# Altium project 388D_Control_v1.PrjPcb (part 3 of 3)

## Sheet 9.Pwm_Buffer.SchDoc
size A3; SheetNumber: 10; SheetTotal: 10
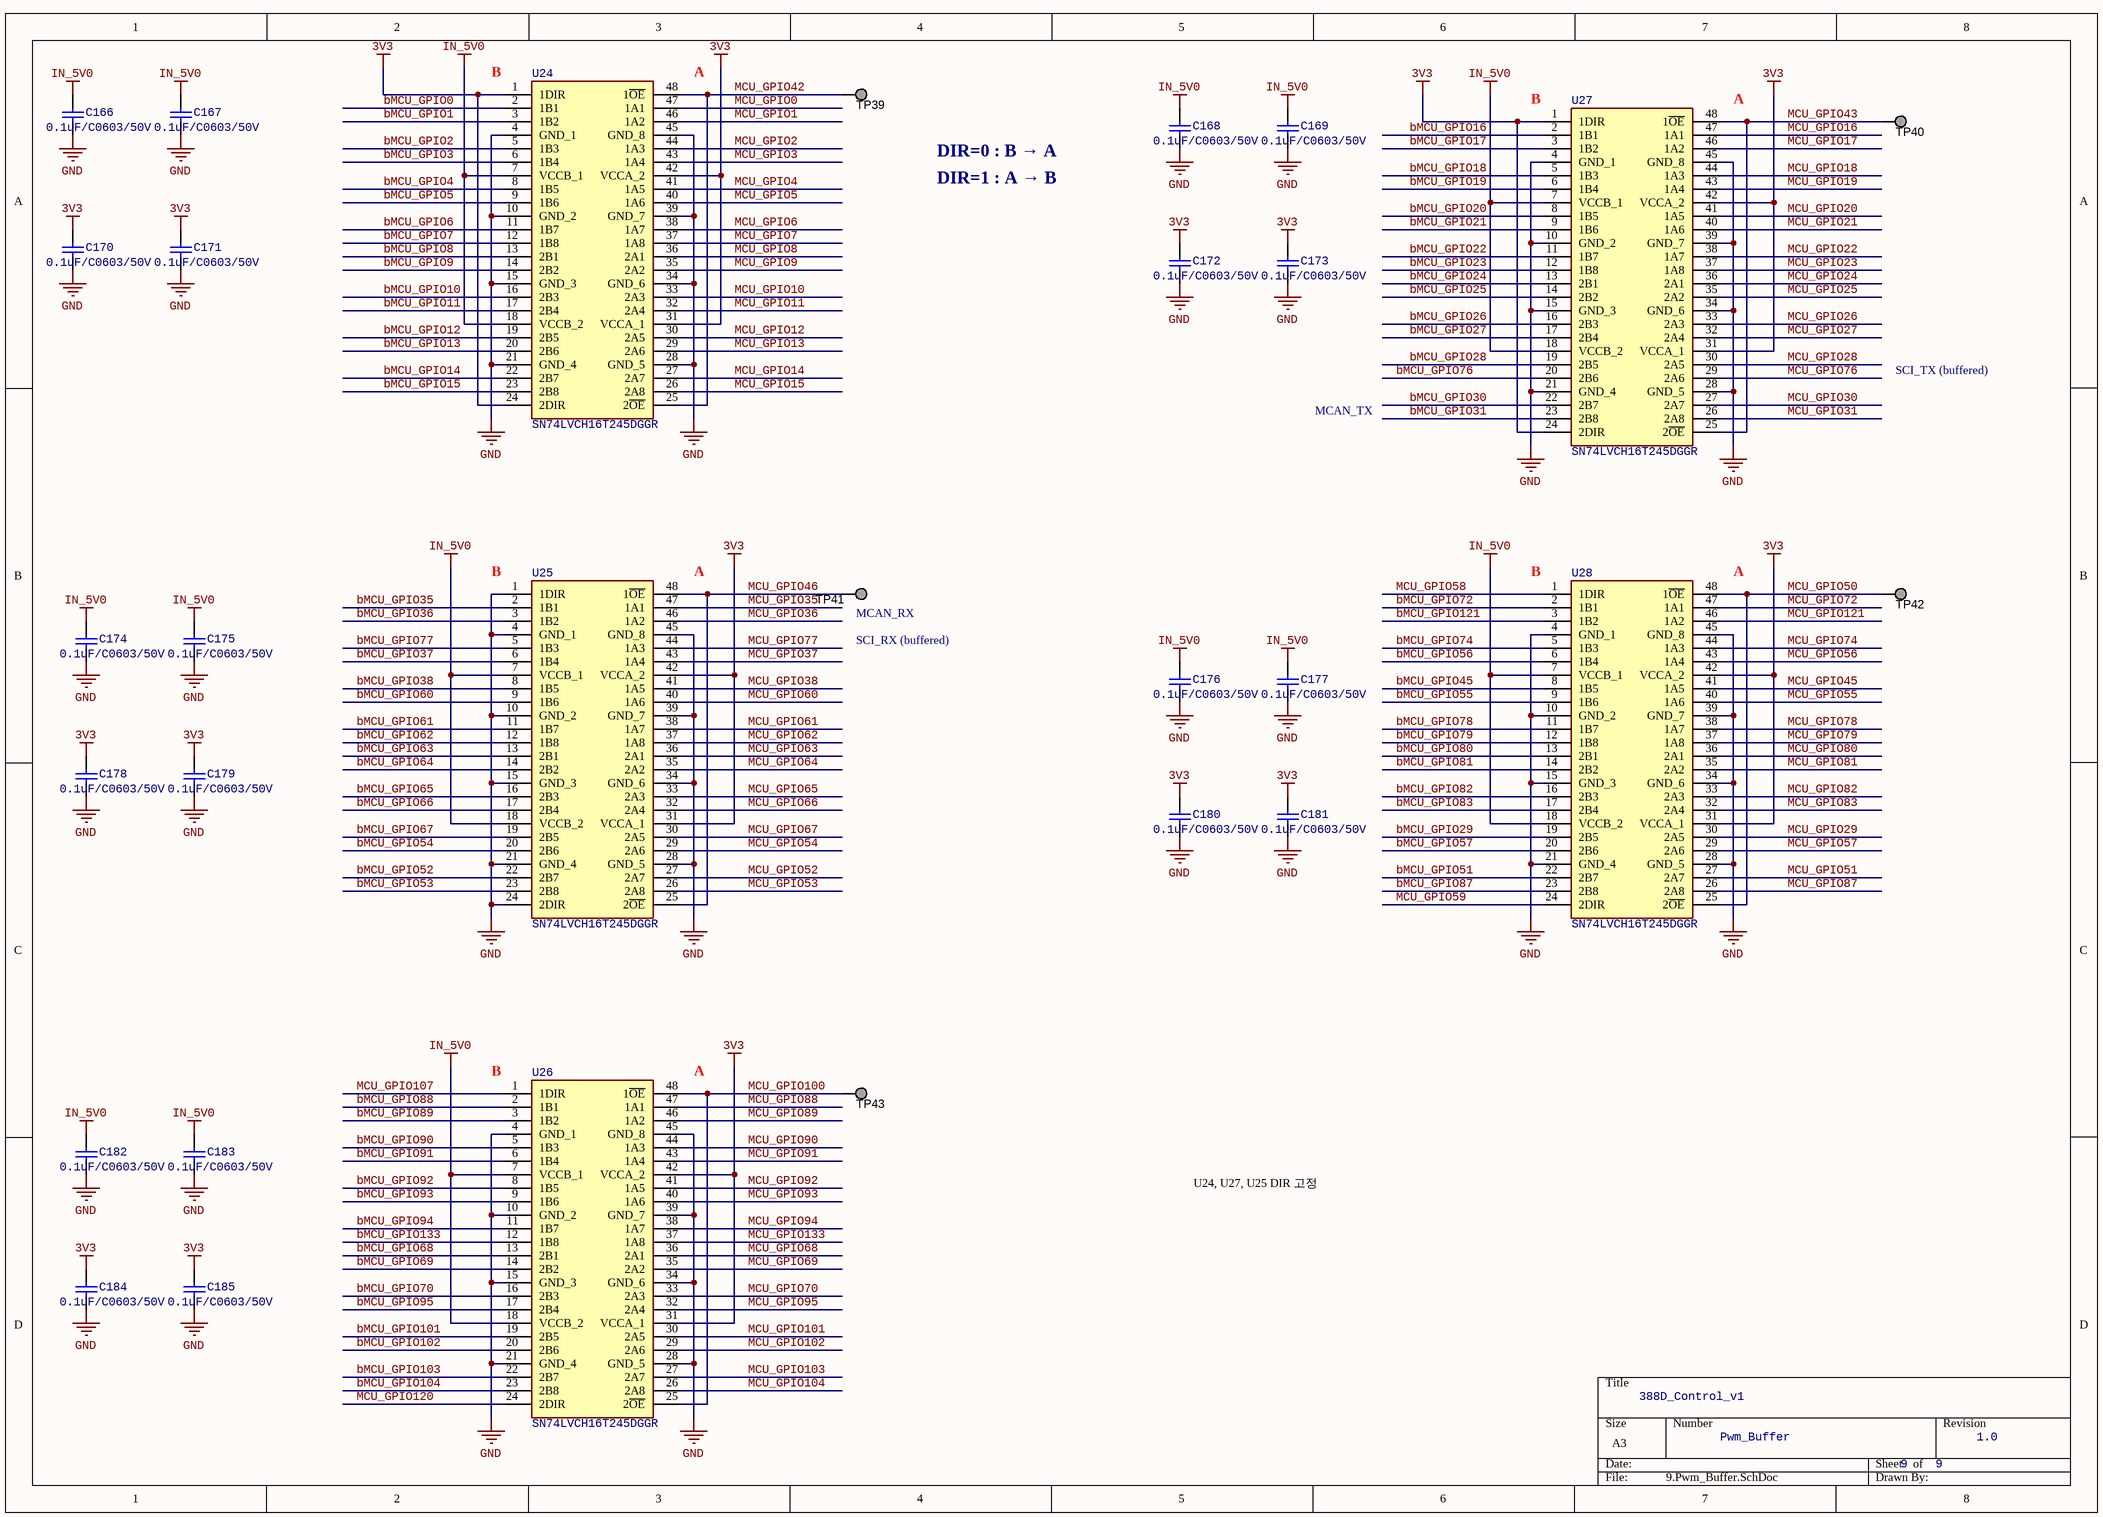
[diagram p8: 9.Pwm_Buffer.SchDoc]

### Parts
C166  value 0.1uF/C0603/50V  [CAPC1608X90X40NL10T20]  (hidden comment: Capacitor 100 nF +/-10% 50 V 0603)
C167  value 0.1uF/C0603/50V  [CAPC1608X90X40NL10T20]  (hidden comment: Capacitor 100 nF +/-10% 50 V 0603)
C168  value 0.1uF/C0603/50V  [CAPC1608X90X40NL10T20]  (hidden comment: Capacitor 100 nF +/-10% 50 V 0603)
C169  value 0.1uF/C0603/50V  [CAPC1608X90X40NL10T20]  (hidden comment: Capacitor 100 nF +/-10% 50 V 0603)
C170  value 0.1uF/C0603/50V  [CAPC1608X90X40NL10T20]  (hidden comment: Capacitor 100 nF +/-10% 50 V 0603)
C171  value 0.1uF/C0603/50V  [CAPC1608X90X40NL10T20]  (hidden comment: Capacitor 100 nF +/-10% 50 V 0603)
C172  value 0.1uF/C0603/50V  [CAPC1608X90X40NL10T20]  (hidden comment: Capacitor 100 nF +/-10% 50 V 0603)
C173  value 0.1uF/C0603/50V  [CAPC1608X90X40NL10T20]  (hidden comment: Capacitor 100 nF +/-10% 50 V 0603)
C174  value 0.1uF/C0603/50V  [CAPC1608X90X40NL10T20]  (hidden comment: Capacitor 100 nF +/-10% 50 V 0603)
C175  value 0.1uF/C0603/50V  [CAPC1608X90X40NL10T20]  (hidden comment: Capacitor 100 nF +/-10% 50 V 0603)
C176  value 0.1uF/C0603/50V  [CAPC1608X90X40NL10T20]  (hidden comment: Capacitor 100 nF +/-10% 50 V 0603)
C177  value 0.1uF/C0603/50V  [CAPC1608X90X40NL10T20]  (hidden comment: Capacitor 100 nF +/-10% 50 V 0603)
C178  value 0.1uF/C0603/50V  [CAPC1608X90X40NL10T20]  (hidden comment: Capacitor 100 nF +/-10% 50 V 0603)
C179  value 0.1uF/C0603/50V  [CAPC1608X90X40NL10T20]  (hidden comment: Capacitor 100 nF +/-10% 50 V 0603)
C180  value 0.1uF/C0603/50V  [CAPC1608X90X40NL10T20]  (hidden comment: Capacitor 100 nF +/-10% 50 V 0603)
C181  value 0.1uF/C0603/50V  [CAPC1608X90X40NL10T20]  (hidden comment: Capacitor 100 nF +/-10% 50 V 0603)
C182  value 0.1uF/C0603/50V  [CAPC1608X90X40NL10T20]  (hidden comment: Capacitor 100 nF +/-10% 50 V 0603)
C183  value 0.1uF/C0603/50V  [CAPC1608X90X40NL10T20]  (hidden comment: Capacitor 100 nF +/-10% 50 V 0603)
C184  value 0.1uF/C0603/50V  [CAPC1608X90X40NL10T20]  (hidden comment: Capacitor 100 nF +/-10% 50 V 0603)
C185  value 0.1uF/C0603/50V  [CAPC1608X90X40NL10T20]  (hidden comment: Capacitor 100 nF +/-10% 50 V 0603)
TP39  TESTPOINT  [TP_50MIL-25MILHOLE]  (value not drawn)  (no BOM)
TP40  TESTPOINT  [TP_50MIL-25MILHOLE]  (value not drawn)  (no BOM)
TP41  TESTPOINT  [TP_50MIL-25MILHOLE]  (value not drawn)  (no BOM)
TP42  TESTPOINT  [TP_50MIL-25MILHOLE]  (value not drawn)  (no BOM)
TP43  TESTPOINT  [TP_50MIL-25MILHOLE]  (value not drawn)  (no BOM)
U24  SN74LVCH16T245DGGR  [SOP50P810X120-48N]
U25  SN74LVCH16T245DGGR  [SOP50P810X120-48N]
U26  SN74LVCH16T245DGGR  [SOP50P810X120-48N]
U27  SN74LVCH16T245DGGR  [SOP50P810X120-48N]
U28  SN74LVCH16T245DGGR  [SOP50P810X120-48N]

### Nets
3V3: C170.1 C171.1 C172.1 C173.1 C178.1 C179.1 C180.1 C181.1 C184.1 C185.1 U24.1(1DIR) U24.24(2DIR) U24.31(VCCA_1) U24.42(VCCA_2) U25.31(VCCA_1) U25.42(VCCA_2) U26.31(VCCA_1) U26.42(VCCA_2) U27.1(1DIR) U27.24(2DIR) U27.31(VCCA_1) U27.42(VCCA_2) U28.31(VCCA_1) U28.42(VCCA_2)
GND: C166.2 C167.2 C168.2 C169.2 C170.2 C171.2 C172.2 C173.2 C174.2 C175.2 C176.2 C177.2 C178.2 C179.2 C180.2 C181.2 C182.2 C183.2 C184.2 C185.2 U24.4(GND_1) U24.10(GND_2) U24.15(GND_3) U24.21(GND_4) U24.28(GND_5) U24.34(GND_6) U24.39(GND_7) U24.45(GND_8) U25.1(1DIR) U25.4(GND_1) U25.10(GND_2) U25.15(GND_3) U25.21(GND_4) U25.24(2DIR) U25.28(GND_5) U25.34(GND_6) U25.39(GND_7) U25.45(GND_8) U26.4(GND_1) U26.10(GND_2) U26.15(GND_3) U26.21(GND_4) U26.28(GND_5) U26.34(GND_6) U26.39(GND_7) U26.45(GND_8) U27.4(GND_1) U27.10(GND_2) U27.15(GND_3) U27.21(GND_4) U27.28(GND_5) U27.34(GND_6) U27.39(GND_7) U27.45(GND_8) U28.4(GND_1) U28.10(GND_2) U28.15(GND_3) U28.21(GND_4) U28.28(GND_5) U28.34(GND_6) U28.39(GND_7) U28.45(GND_8)
IN_5V0: C166.1 C167.1 C168.1 C169.1 C174.1 C175.1 C176.1 C177.1 C182.1 C183.1 U24.7(VCCB_1) U24.18(VCCB_2) U25.7(VCCB_1) U25.18(VCCB_2) U26.7(VCCB_1) U26.18(VCCB_2) U27.7(VCCB_1) U27.18(VCCB_2) U28.7(VCCB_1) U28.18(VCCB_2)
bMCU_GPIO0: U24.2(1B1)
bMCU_GPIO1: U24.3(1B2)
bMCU_GPIO2: U24.5(1B3)
bMCU_GPIO3: U24.6(1B4)
bMCU_GPIO4: U24.8(1B5)
bMCU_GPIO5: U24.9(1B6)
bMCU_GPIO6: U24.11(1B7)
bMCU_GPIO7: U24.12(1B8)
bMCU_GPIO8: U24.13(2B1)
bMCU_GPIO9: U24.14(2B2)
bMCU_GPIO10: U24.16(2B3)
bMCU_GPIO11: U24.17(2B4)
bMCU_GPIO12: U24.19(2B5)
bMCU_GPIO13: U24.20(2B6)
bMCU_GPIO14: U24.22(2B7)
bMCU_GPIO15: U24.23(2B8)
bMCU_GPIO16: U27.2(1B1)
bMCU_GPIO17: U27.3(1B2)
bMCU_GPIO18: U27.5(1B3)
bMCU_GPIO19: U27.6(1B4)
bMCU_GPIO20: U27.8(1B5)
bMCU_GPIO21: U27.9(1B6)
bMCU_GPIO22: U27.11(1B7)
bMCU_GPIO23: U27.12(1B8)
bMCU_GPIO24: U27.13(2B1)
bMCU_GPIO25: U27.14(2B2)
bMCU_GPIO26: U27.16(2B3)
bMCU_GPIO27: U27.17(2B4)
bMCU_GPIO28: U27.19(2B5)
bMCU_GPIO29: U28.19(2B5)
bMCU_GPIO30: U27.22(2B7)
bMCU_GPIO31: U27.23(2B8)
bMCU_GPIO35: U25.2(1B1)
bMCU_GPIO36: U25.3(1B2)
bMCU_GPIO37: U25.6(1B4)
bMCU_GPIO38: U25.8(1B5)
bMCU_GPIO45: U28.8(1B5)
bMCU_GPIO51: U28.22(2B7)
bMCU_GPIO52: U25.22(2B7)
bMCU_GPIO53: U25.23(2B8)
bMCU_GPIO54: U25.20(2B6)
bMCU_GPIO55: U28.9(1B6)
bMCU_GPIO56: U28.6(1B4)
bMCU_GPIO57: U28.20(2B6)
bMCU_GPIO60: U25.9(1B6)
bMCU_GPIO61: U25.11(1B7)
bMCU_GPIO62: U25.12(1B8)
bMCU_GPIO63: U25.13(2B1)
bMCU_GPIO64: U25.14(2B2)
bMCU_GPIO65: U25.16(2B3)
bMCU_GPIO66: U25.17(2B4)
bMCU_GPIO67: U25.19(2B5)
bMCU_GPIO68: U26.13(2B1)
bMCU_GPIO69: U26.14(2B2)
bMCU_GPIO70: U26.16(2B3)
bMCU_GPIO72: U28.2(1B1)
bMCU_GPIO74: U28.5(1B3)
bMCU_GPIO76: U27.20(2B6)
bMCU_GPIO77: U25.5(1B3)
bMCU_GPIO78: U28.11(1B7)
bMCU_GPIO79: U28.12(1B8)
bMCU_GPIO80: U28.13(2B1)
bMCU_GPIO81: U28.14(2B2)
bMCU_GPIO82: U28.16(2B3)
bMCU_GPIO83: U28.17(2B4)
bMCU_GPIO87: U28.23(2B8)
bMCU_GPIO88: U26.2(1B1)
bMCU_GPIO89: U26.3(1B2)
bMCU_GPIO90: U26.5(1B3)
bMCU_GPIO91: U26.6(1B4)
bMCU_GPIO92: U26.8(1B5)
bMCU_GPIO93: U26.9(1B6)
bMCU_GPIO94: U26.11(1B7)
bMCU_GPIO95: U26.17(2B4)
bMCU_GPIO101: U26.19(2B5)
bMCU_GPIO102: U26.20(2B6)
bMCU_GPIO103: U26.22(2B7)
bMCU_GPIO104: U26.23(2B8)
bMCU_GPIO121: U28.3(1B2)
bMCU_GPIO133: U26.12(1B8)
MCU_GPIO0: U24.47(1A1)
MCU_GPIO1: U24.46(1A2)
MCU_GPIO2: U24.44(1A3)
MCU_GPIO3: U24.43(1A4)
MCU_GPIO4: U24.41(1A5)
MCU_GPIO5: U24.40(1A6)
MCU_GPIO6: U24.38(1A7)
MCU_GPIO7: U24.37(1A8)
MCU_GPIO8: U24.36(2A1)
MCU_GPIO9: U24.35(2A2)
MCU_GPIO10: U24.33(2A3)
MCU_GPIO11: U24.32(2A4)
MCU_GPIO12: U24.30(2A5)
MCU_GPIO13: U24.29(2A6)
MCU_GPIO14: U24.27(2A7)
MCU_GPIO15: U24.26(2A8)
MCU_GPIO16: U27.47(1A1)
MCU_GPIO17: U27.46(1A2)
MCU_GPIO18: U27.44(1A3)
MCU_GPIO19: U27.43(1A4)
MCU_GPIO20: U27.41(1A5)
MCU_GPIO21: U27.40(1A6)
MCU_GPIO22: U27.38(1A7)
MCU_GPIO23: U27.37(1A8)
MCU_GPIO24: U27.36(2A1)
MCU_GPIO25: U27.35(2A2)
MCU_GPIO26: U27.33(2A3)
MCU_GPIO27: U27.32(2A4)
MCU_GPIO28: U27.30(2A5)
MCU_GPIO29: U28.30(2A5)
MCU_GPIO30: U27.27(2A7)
MCU_GPIO31: U27.26(2A8)
MCU_GPIO35: U25.47(1A1)
MCU_GPIO36: U25.46(1A2)
MCU_GPIO37: U25.43(1A4)
MCU_GPIO38: U25.41(1A5)
MCU_GPIO42: TP39.1 U24.25(2~{OE}) U24.48(1~{OE})
MCU_GPIO43: TP40.1 U27.25(2~{OE}) U27.48(1~{OE})
MCU_GPIO45: U28.41(1A5)
MCU_GPIO46: TP41.1 U25.25(2~{OE}) U25.48(1~{OE})
MCU_GPIO50: TP42.1 U28.25(2~{OE}) U28.48(1~{OE})
MCU_GPIO51: U28.27(2A7)
MCU_GPIO52: U25.27(2A7)
MCU_GPIO53: U25.26(2A8)
MCU_GPIO54: U25.29(2A6)
MCU_GPIO55: U28.40(1A6)
MCU_GPIO56: U28.43(1A4)
MCU_GPIO57: U28.29(2A6)
MCU_GPIO58: U28.1(1DIR)
MCU_GPIO59: U28.24(2DIR)
MCU_GPIO60: U25.40(1A6)
MCU_GPIO61: U25.38(1A7)
MCU_GPIO62: U25.37(1A8)
MCU_GPIO63: U25.36(2A1)
MCU_GPIO64: U25.35(2A2)
MCU_GPIO65: U25.33(2A3)
MCU_GPIO66: U25.32(2A4)
MCU_GPIO67: U25.30(2A5)
MCU_GPIO68: U26.36(2A1)
MCU_GPIO69: U26.35(2A2)
MCU_GPIO70: U26.33(2A3)
MCU_GPIO72: U28.47(1A1)
MCU_GPIO74: U28.44(1A3)
MCU_GPIO76: U27.29(2A6)
MCU_GPIO77: U25.44(1A3)
MCU_GPIO78: U28.38(1A7)
MCU_GPIO79: U28.37(1A8)
MCU_GPIO80: U28.36(2A1)
MCU_GPIO81: U28.35(2A2)
MCU_GPIO82: U28.33(2A3)
MCU_GPIO83: U28.32(2A4)
MCU_GPIO87: U28.26(2A8)
MCU_GPIO88: U26.47(1A1)
MCU_GPIO89: U26.46(1A2)
MCU_GPIO90: U26.44(1A3)
MCU_GPIO91: U26.43(1A4)
MCU_GPIO92: U26.41(1A5)
MCU_GPIO93: U26.40(1A6)
MCU_GPIO94: U26.38(1A7)
MCU_GPIO95: U26.32(2A4)
MCU_GPIO100: TP43.1 U26.25(2~{OE}) U26.48(1~{OE})
MCU_GPIO101: U26.30(2A5)
MCU_GPIO102: U26.29(2A6)
MCU_GPIO103: U26.27(2A7)
MCU_GPIO104: U26.26(2A8)
MCU_GPIO107: U26.1(1DIR)
MCU_GPIO120: U26.24(2DIR)
MCU_GPIO121: U28.46(1A2)
MCU_GPIO133: U26.37(1A8)

### Notes on the sheet
- (near U24) B
- (near U24) A
- (near U27) B
- (near U27) A
- DIR=0 : B → A
- DIR=1 : A → B
- SCI_TX (buffered)
- MCAN_TX
- (near U25) B
- (near U25) A
- (near U28) B
- (near U28) A
- (near TP41) MCAN_RX
- (near TP41) SCI_RX (buffered)
- (near U26) B
- (near U26) A
- U24, U27, U25 DIR 고정
- 388D_Control_v1
- Pwm_Buffer
- 9    9
- 1.0

### Library data of the parts
C166-C185 = CMP-001-00017-6: Chip Capacitor, 100 nF, +/- 10%, 50 V, 0603 (1608 Metric); Voltage Rating: 50V; Capacitor Type: Ceramic; Tolerance: 10%; Mounting Technology: SM; Max Operating Temperature: 125°C; RoHS Compliant: True; Pins: 2; Case/Package: 0603; Min Operating Temperature: -55°C
TP39-TP43 = CMP-0078143-3: TEST POINT.  No entry in BOM.; CompType: Testpoint; PackageReference: N/A; Manufacturer: N/A; PartNumber: N/A; Library Reference: TESTPOINT
U24-U28 = CMP-031-00095-1: 16-Bit Dual-Supply Bus Transceiver; Manufacturer_Name: Texas Instruments; Arrow Part Number: SN74LVCH16T245DGGR; Source: 388D_Control_v1.SchLib; Arrow Price/Stock: https://www.arrow.com/en/products/sn74lvch16t245dggr/texas-instruments; Height: 1.2mm; Mouser Part Number: 595-SN74LVCH16T245GR; Manufacturer_Part_Number: SN74LVCH16T245DGGR; Datasheet Link: http://www.ti.com/lit/gpn/sn74lvch16t245; Mouser Price/Stock: https://www.mouser.co.uk/ProductDetail/Texas-Instruments/SN74LVCH16T245DGGR?qs=dT9u2OTAaVU%2FCf3PTalIAw%3D%3D; Design Item ID: SN74LVCH16T245DGGR

## Nets that join several sheets
3V3: 1.GPIO (J2.21), 4.Power (10 pins), 9.Pwm_Buffer (24 pins)
GND: 1.GPIO (19 pins), 2.Support (20 pins), 3.ADC (40 pins), 4.Power (120 pins), 5.ETH (J12.9 J12.51 J12.83), 8.Emulator_Interface (6 pins), 9.Pwm_Buffer (62 pins)
HSEC_5V0: 1.GPIO (5 pins), 4.Power (D1.2 TP1.1)
IN_5V0: 4.Power (7 pins), 9.Pwm_Buffer (20 pins)
VDD_1V2: 1.GPIO (J2.20), 2.Support (U7.3), 4.Power (25 pins)
VDD_3V3: 1.GPIO (8 pins), 2.Support (21 pins), 4.Power (51 pins), 8.Emulator_Interface (7 pins)
VDDA_3V3: 3.ADC (9 pins), 4.Power (6 pins)
ADC_A0A1_N: 1.GPIO (J1.58), 3.ADC (R11.2)
ADC_A0A1_P: 1.GPIO (J1.60), 3.ADC (R10.2)
ADC_A2A3_N: 1.GPIO (J1.59), 3.ADC (R13.2)
ADC_A2A3_P: 1.GPIO (J1.61), 3.ADC (R12.2)
ADC_A4A5_N: 1.GPIO (J1.53), 3.ADC (R15.2)
ADC_A4A5_P: 1.GPIO (J1.55), 3.ADC (R14.2)
ADC_B0B1_N: 1.GPIO (J1.66), 3.ADC (R20.2)
ADC_B0B1_P: 1.GPIO (J1.64), 3.ADC (R19.2)
ADC_B2B3_N: 1.GPIO (J1.65), 3.ADC (R22.2)
ADC_B2B3_P: 1.GPIO (J1.63), 3.ADC (R21.2)
ADC_B4B5_N: 1.GPIO (J1.70), 3.ADC (R24.2)
ADC_B4B5_P: 1.GPIO (J1.68), 3.ADC (R23.2)
ADC_C2C3_N: 1.GPIO (J1.52), 3.ADC (R27.2)
ADC_C2C3_P: 1.GPIO (J1.54), 3.ADC (R26.2)
ADC_C4C5_N: 1.GPIO (J1.47), 3.ADC (R29.2)
ADC_C4C5_P: 1.GPIO (J1.49), 3.ADC (R28.2)
ADC_D0D1_N: 1.GPIO (J1.71), 3.ADC (R32.2)
ADC_D0D1_P: 1.GPIO (J1.69), 3.ADC (R31.2)
ADC_D2D3_N: 1.GPIO (J1.77), 3.ADC (R34.2)
ADC_D2D3_P: 1.GPIO (J1.75), 3.ADC (R33.2)
ADC_D4D5_N: 1.GPIO (J1.82), 3.ADC (R36.2)
ADC_D4D5_P: 1.GPIO (J1.80), 3.ADC (R35.2)
ADC_IN1415_N: 1.GPIO (J1.74), 3.ADC (R18.2)
ADC_IN1415_P: 1.GPIO (J1.76), 3.ADC (R17.2)
bMCU_GPIO0: 1.GPIO (J1.9 TP15.1), 9.Pwm_Buffer (U24.2)
bMCU_GPIO1: 1.GPIO (J1.11 TP16.1), 9.Pwm_Buffer (U24.3)
bMCU_GPIO2: 1.GPIO (J1.13 TP17.1), 9.Pwm_Buffer (U24.5)
bMCU_GPIO3: 1.GPIO (J1.15 TP19.1), 9.Pwm_Buffer (U24.6)
bMCU_GPIO4: 1.GPIO (J1.14 TP18.1), 9.Pwm_Buffer (U24.8)
bMCU_GPIO5: 1.GPIO (J1.16 TP20.1), 9.Pwm_Buffer (U24.9)
bMCU_GPIO6: 1.GPIO (J1.18 TP21.1), 9.Pwm_Buffer (U24.11)
bMCU_GPIO7: 1.GPIO (J1.20 TP23.1), 9.Pwm_Buffer (U24.12)
bMCU_GPIO8: 1.GPIO (J1.19 TP22.1), 9.Pwm_Buffer (U24.13)
bMCU_GPIO9: 1.GPIO (J1.21 TP24.1), 9.Pwm_Buffer (U24.14)
bMCU_GPIO10: 1.GPIO (J1.23 TP25.1), 9.Pwm_Buffer (U24.16)
bMCU_GPIO11: 1.GPIO (J1.25 TP27.1), 9.Pwm_Buffer (U24.17)
bMCU_GPIO12: 1.GPIO (J1.24 TP26.1), 9.Pwm_Buffer (U24.19)
bMCU_GPIO13: 1.GPIO (J1.26 TP28.1), 9.Pwm_Buffer (U24.20)
bMCU_GPIO14: 1.GPIO (J1.28 TP29.1), 9.Pwm_Buffer (U24.22)
bMCU_GPIO15: 1.GPIO (J1.30 TP31.1), 9.Pwm_Buffer (U24.23)
bMCU_GPIO16: 1.GPIO (J1.29 TP30.1), 9.Pwm_Buffer (U27.2)
bMCU_GPIO17: 1.GPIO (J1.31 TP32.1), 9.Pwm_Buffer (U27.3)
bMCU_GPIO18: 1.GPIO (J1.33 TP33.1), 9.Pwm_Buffer (U27.5)
bMCU_GPIO19: 1.GPIO (J1.35 TP35.1), 9.Pwm_Buffer (U27.6)
bMCU_GPIO20: 1.GPIO (J1.34 TP34.1), 9.Pwm_Buffer (U27.8)
bMCU_GPIO21: 1.GPIO (J1.36 TP36.1), 9.Pwm_Buffer (U27.9)
bMCU_GPIO22: 1.GPIO (J1.38 TP37.1), 9.Pwm_Buffer (U27.11)
bMCU_GPIO23: 1.GPIO (J1.40 TP38.1), 9.Pwm_Buffer (U27.12)
bMCU_GPIO24: 1.GPIO (J1.37), 9.Pwm_Buffer (U27.13)
bMCU_GPIO25: 1.GPIO (J1.39), 9.Pwm_Buffer (U27.14)
bMCU_GPIO26: 1.GPIO (J1.41), 9.Pwm_Buffer (U27.16)
bMCU_GPIO27: 1.GPIO (J1.43), 9.Pwm_Buffer (U27.17)
bMCU_GPIO28: 1.GPIO (J1.42), 9.Pwm_Buffer (U27.19)
bMCU_GPIO29: 1.GPIO (J2.53), 9.Pwm_Buffer (U28.19)
bMCU_GPIO30: 1.GPIO (J1.46), 9.Pwm_Buffer (U27.22)
bMCU_GPIO31: 1.GPIO (J1.48), 9.Pwm_Buffer (U27.23)
bMCU_GPIO35: 1.GPIO (J2.23), 9.Pwm_Buffer (U25.2)
bMCU_GPIO36: 1.GPIO (J2.24), 9.Pwm_Buffer (U25.3)
bMCU_GPIO37: 1.GPIO (J2.26), 9.Pwm_Buffer (U25.6)
bMCU_GPIO38: 1.GPIO (J2.27), 9.Pwm_Buffer (U25.8)
bMCU_GPIO45: 1.GPIO (J2.45), 9.Pwm_Buffer (U28.8)
bMCU_GPIO51: 1.GPIO (J2.55), 9.Pwm_Buffer (U28.22)
bMCU_GPIO52: 1.GPIO (J2.37), 9.Pwm_Buffer (U25.22)
bMCU_GPIO53: 1.GPIO (J2.38), 9.Pwm_Buffer (U25.23)
bMCU_GPIO54: 1.GPIO (J2.36), 9.Pwm_Buffer (U25.20)
bMCU_GPIO55: 1.GPIO (J2.46), 9.Pwm_Buffer (U28.9)
bMCU_GPIO56: 1.GPIO (J2.44), 9.Pwm_Buffer (U28.6)
bMCU_GPIO57: 1.GPIO (J2.54), 9.Pwm_Buffer (U28.20)
bMCU_GPIO60: 1.GPIO (J2.28), 9.Pwm_Buffer (U25.9)
bMCU_GPIO61: 1.GPIO (J2.29), 9.Pwm_Buffer (U25.11)
bMCU_GPIO62: 1.GPIO (J2.30), 9.Pwm_Buffer (U25.12)
bMCU_GPIO63: 1.GPIO (J2.31), 9.Pwm_Buffer (U25.13)
bMCU_GPIO64: 1.GPIO (J2.32), 9.Pwm_Buffer (U25.14)
bMCU_GPIO65: 1.GPIO (J2.33), 9.Pwm_Buffer (U25.16)
bMCU_GPIO66: 1.GPIO (J2.34), 9.Pwm_Buffer (U25.17)
bMCU_GPIO67: 1.GPIO (J2.35), 9.Pwm_Buffer (U25.19)
bMCU_GPIO68: 1.GPIO (J2.79), 9.Pwm_Buffer (U26.13)
bMCU_GPIO69: 1.GPIO (J2.80), 9.Pwm_Buffer (U26.14)
bMCU_GPIO70: 1.GPIO (J2.81), 9.Pwm_Buffer (U26.16)
bMCU_GPIO72: 1.GPIO (J2.41), 9.Pwm_Buffer (U28.2)
bMCU_GPIO74: 1.GPIO (J2.43), 9.Pwm_Buffer (U28.5)
bMCU_GPIO76: 1.GPIO (J1.44), 9.Pwm_Buffer (U27.20)
bMCU_GPIO77: 1.GPIO (J2.25), 9.Pwm_Buffer (U25.5)
bMCU_GPIO78: 1.GPIO (J2.47), 9.Pwm_Buffer (U28.11)
bMCU_GPIO79: 1.GPIO (J2.48), 9.Pwm_Buffer (U28.12)
bMCU_GPIO80: 1.GPIO (J2.49), 9.Pwm_Buffer (U28.13)
bMCU_GPIO81: 1.GPIO (J2.50), 9.Pwm_Buffer (U28.14)
bMCU_GPIO82: 1.GPIO (J2.51), 9.Pwm_Buffer (U28.16)
bMCU_GPIO83: 1.GPIO (J2.52), 9.Pwm_Buffer (U28.17)
bMCU_GPIO87: 1.GPIO (J2.56), 9.Pwm_Buffer (U28.23)
bMCU_GPIO88: 1.GPIO (J2.71), 9.Pwm_Buffer (U26.2)
bMCU_GPIO89: 1.GPIO (J2.72), 9.Pwm_Buffer (U26.3)
bMCU_GPIO90: 1.GPIO (J2.73), 9.Pwm_Buffer (U26.5)
bMCU_GPIO91: 1.GPIO (J2.74), 9.Pwm_Buffer (U26.6)
bMCU_GPIO92: 1.GPIO (J2.75), 9.Pwm_Buffer (U26.8)
bMCU_GPIO93: 1.GPIO (J2.76), 9.Pwm_Buffer (U26.9)
bMCU_GPIO94: 1.GPIO (J2.77), 9.Pwm_Buffer (U26.11)
bMCU_GPIO95: 1.GPIO (J2.82), 9.Pwm_Buffer (U26.17)
bMCU_GPIO101: 1.GPIO (J2.83), 9.Pwm_Buffer (U26.19)
bMCU_GPIO102: 1.GPIO (J2.84), 9.Pwm_Buffer (U26.20)
bMCU_GPIO103: 1.GPIO (J2.85), 9.Pwm_Buffer (U26.22)
bMCU_GPIO104: 1.GPIO (J2.86), 9.Pwm_Buffer (U26.23)
bMCU_GPIO121: 1.GPIO (J2.42), 9.Pwm_Buffer (U28.3)
bMCU_GPIO133: 1.GPIO (J2.78), 9.Pwm_Buffer (U26.12)
ENET_PHY_CLK: 2.Support (R77.2), 5.ETH (J12.31)
ERRORSTS: 1.GPIO (J2.90), 2.Support (R64.2 TP5.1 U1#1.U19)
HSEC_ADC-VREFHI: 1.GPIO (J1.83), 3.ADC (R41.1)
MCU_GPIO0: 1.GPIO (U1#1.C8), 9.Pwm_Buffer (U24.47)
MCU_GPIO1: 1.GPIO (U1#1.D8), 9.Pwm_Buffer (U24.46)
MCU_GPIO2: 1.GPIO (U1#1.A7), 9.Pwm_Buffer (U24.44)
MCU_GPIO3: 1.GPIO (U1#1.B7), 9.Pwm_Buffer (U24.43)
MCU_GPIO4: 1.GPIO (U1#1.C7), 9.Pwm_Buffer (U24.41)
MCU_GPIO5: 1.GPIO (U1#1.D7), 9.Pwm_Buffer (U24.40)
MCU_GPIO6: 1.GPIO (U1#1.A6), 9.Pwm_Buffer (U24.38)
MCU_GPIO7: 1.GPIO (U1#1.B6), 9.Pwm_Buffer (U24.37)
MCU_GPIO8: 1.GPIO (U1#1.G2), 9.Pwm_Buffer (U24.36)
MCU_GPIO9: 1.GPIO (U1#1.G3), 9.Pwm_Buffer (U24.35)
MCU_GPIO10: 1.GPIO (U1#1.B2), 9.Pwm_Buffer (U24.33)
MCU_GPIO11: 1.GPIO (U1#1.C1), 9.Pwm_Buffer (U24.32)
MCU_GPIO12: 1.GPIO (U1#1.C2), 9.Pwm_Buffer (U24.30)
MCU_GPIO13: 1.GPIO (U1#1.D1), 9.Pwm_Buffer (U24.29)
MCU_GPIO14: 1.GPIO (U1#1.D2), 9.Pwm_Buffer (U24.27)
MCU_GPIO15: 1.GPIO (U1#1.D3), 9.Pwm_Buffer (U24.26)
MCU_GPIO16: 1.GPIO (U1#1.E1), 9.Pwm_Buffer (U27.47)
MCU_GPIO17: 1.GPIO (U1#1.E2), 9.Pwm_Buffer (U27.46)
MCU_GPIO18: 1.GPIO (U1#1.E3), 9.Pwm_Buffer (U27.44)
MCU_GPIO19: 1.GPIO (U1#1.E4), 9.Pwm_Buffer (U27.43)
MCU_GPIO20: 1.GPIO (U1#1.F2), 9.Pwm_Buffer (U27.41)
MCU_GPIO21: 1.GPIO (U1#1.F3), 9.Pwm_Buffer (U27.40)
MCU_GPIO22: 1.GPIO (U1#1.J4), 9.Pwm_Buffer (U27.38)
MCU_GPIO23: 1.GPIO (U1#1.K4), 9.Pwm_Buffer (U27.37)
MCU_GPIO24: 1.GPIO (U1#1.K3), 9.Pwm_Buffer (U27.36)
MCU_GPIO25: 1.GPIO (U1#1.K2), 9.Pwm_Buffer (U27.35)
MCU_GPIO26: 1.GPIO (U1#1.K1), 9.Pwm_Buffer (U27.33)
MCU_GPIO27: 1.GPIO (U1#1.L1), 9.Pwm_Buffer (U27.32)
MCU_GPIO28: 1.GPIO (U1#1.V11), 9.Pwm_Buffer (U27.30)
MCU_GPIO29: 1.GPIO (U1#1.W11), 9.Pwm_Buffer (U28.30)
MCU_GPIO30: 1.GPIO (U1#1.T11), 9.Pwm_Buffer (U27.27)
MCU_GPIO31: 1.GPIO (U1#1.U11), 2.Support (R69.1 U2.1), 9.Pwm_Buffer (U27.26)
MCU_GPIO34: 1.GPIO (J1.96 R166.1 U1#1.U14), 2.Support (R70.1 U2.3)
MCU_GPIO35: 1.GPIO (U1#1.T14), 9.Pwm_Buffer (U25.47)
MCU_GPIO36: 1.GPIO (U1#1.V16), 9.Pwm_Buffer (U25.46)
MCU_GPIO37: 1.GPIO (U1#1.U16), 9.Pwm_Buffer (U25.43)
MCU_GPIO38: 1.GPIO (U1#1.T16), 9.Pwm_Buffer (U25.41)
MCU_GPIO41: 1.GPIO (U1#1.U17), 5.ETH (J12.2)
MCU_GPIO42: 1.GPIO (U1#1.D19), 9.Pwm_Buffer (TP39.1 U24.25 U24.48)
MCU_GPIO43: 1.GPIO (U1#1.C19), 9.Pwm_Buffer (TP40.1 U27.25 U27.48)
MCU_GPIO44: 1.GPIO (U1#1.K18), 5.ETH (J12.21)
MCU_GPIO45: 1.GPIO (U1#1.K19), 9.Pwm_Buffer (U28.41)
MCU_GPIO46: 1.GPIO (U1#1.E19), 9.Pwm_Buffer (TP41.1 U25.25 U25.48)
MCU_GPIO47: 1.GPIO (U1#1.E18), 5.ETH (J12.44)
MCU_GPIO48: 1.GPIO (U1#1.R16), 5.ETH (J12.12)
MCU_GPIO50: 1.GPIO (U1#1.R18), 9.Pwm_Buffer (TP42.1 U28.25 U28.48)
MCU_GPIO51: 1.GPIO (U1#1.R19), 9.Pwm_Buffer (U28.27)
MCU_GPIO52: 1.GPIO (U1#1.P16), 9.Pwm_Buffer (U25.27)
MCU_GPIO53: 1.GPIO (U1#1.P17), 9.Pwm_Buffer (U25.26)
MCU_GPIO54: 1.GPIO (U1#1.P18), 9.Pwm_Buffer (U25.29)
MCU_GPIO55: 1.GPIO (U1#1.P19), 9.Pwm_Buffer (U28.40)
MCU_GPIO56: 1.GPIO (U1#1.N16), 9.Pwm_Buffer (U28.43)
MCU_GPIO57: 1.GPIO (U1#1.N18), 9.Pwm_Buffer (U28.29)
MCU_GPIO58: 1.GPIO (U1#1.N17), 9.Pwm_Buffer (U28.1)
MCU_GPIO59: 1.GPIO (R3.1), 9.Pwm_Buffer (U28.24)
MCU_GPIO60: 1.GPIO (U1#1.M17), 9.Pwm_Buffer (U25.40)
MCU_GPIO61: 1.GPIO (R4.1), 9.Pwm_Buffer (U25.38)
MCU_GPIO62: 1.GPIO (U1#1.J17), 9.Pwm_Buffer (U25.37)
MCU_GPIO63: 1.GPIO (U1#1.J16), 9.Pwm_Buffer (U25.36)
MCU_GPIO64: 1.GPIO (R5.1), 9.Pwm_Buffer (U25.35)
MCU_GPIO65: 1.GPIO (U1#1.K16), 9.Pwm_Buffer (U25.33)
MCU_GPIO66: 1.GPIO (R6.1), 9.Pwm_Buffer (U25.32)
MCU_GPIO67: 1.GPIO (U1#1.B19), 9.Pwm_Buffer (U25.30)
MCU_GPIO68: 1.GPIO (U1#1.C18), 9.Pwm_Buffer (U26.36)
MCU_GPIO69: 1.GPIO (U1#1.B18), 9.Pwm_Buffer (U26.35)
MCU_GPIO70: 1.GPIO (R7.1), 9.Pwm_Buffer (U26.33)
MCU_GPIO72: 1.GPIO (R8.1 R167.1), 2.Support (R74.2 S4.2), 9.Pwm_Buffer (U28.47)
MCU_GPIO73: 1.GPIO (U1#1.A16), 5.ETH (J12.46)
MCU_GPIO74: 1.GPIO (U1#1.C17), 9.Pwm_Buffer (U28.44)
MCU_GPIO75: 1.GPIO (U1#1.D16), 5.ETH (J12.43)
MCU_GPIO76: 1.GPIO (U1#1.C16), 9.Pwm_Buffer (U27.29)
MCU_GPIO77: 1.GPIO (U1#1.A15), 9.Pwm_Buffer (U25.44)
MCU_GPIO78: 1.GPIO (U1#1.B15), 9.Pwm_Buffer (U28.38)
MCU_GPIO79: 1.GPIO (U1#1.C15), 9.Pwm_Buffer (U28.37)
MCU_GPIO80: 1.GPIO (U1#1.D15), 9.Pwm_Buffer (U28.36)
MCU_GPIO81: 1.GPIO (U1#1.A14), 9.Pwm_Buffer (U28.35)
MCU_GPIO82: 1.GPIO (U1#1.B14), 9.Pwm_Buffer (U28.33)
MCU_GPIO83: 1.GPIO (U1#1.C14), 9.Pwm_Buffer (U28.32)
MCU_GPIO84: 1.GPIO (J2.97 R168.1 U1#1.A11), 2.Support (R75.1 S4.1)
MCU_GPIO87: 1.GPIO (U1#1.D11), 9.Pwm_Buffer (U28.26)
MCU_GPIO88: 1.GPIO (U1#1.C6), 9.Pwm_Buffer (U26.47)
MCU_GPIO89: 1.GPIO (U1#1.D6), 9.Pwm_Buffer (U26.46)
MCU_GPIO90: 1.GPIO (U1#1.A5), 9.Pwm_Buffer (U26.44)
MCU_GPIO91: 1.GPIO (U1#1.B5), 9.Pwm_Buffer (U26.43)
MCU_GPIO92: 1.GPIO (U1#1.A4), 9.Pwm_Buffer (U26.41)
MCU_GPIO93: 1.GPIO (U1#1.B4), 9.Pwm_Buffer (U26.40)
MCU_GPIO94: 1.GPIO (U1#1.A3), 9.Pwm_Buffer (U26.38)
MCU_GPIO95: 1.GPIO (U1#1.B3), 9.Pwm_Buffer (U26.32)
MCU_GPIO100: 1.GPIO (U1#1.H1), 9.Pwm_Buffer (TP43.1 U26.25 U26.48)
MCU_GPIO101: 1.GPIO (U1#1.H2), 9.Pwm_Buffer (U26.30)
MCU_GPIO102: 1.GPIO (U1#1.H3), 9.Pwm_Buffer (U26.29)
MCU_GPIO103: 1.GPIO (U1#1.J1), 9.Pwm_Buffer (U26.27)
MCU_GPIO104: 1.GPIO (U1#1.J2), 9.Pwm_Buffer (U26.26)
MCU_GPIO105: 1.GPIO (U1#1.J3), 5.ETH (J12.100)
MCU_GPIO106: 1.GPIO (U1#1.L2), 5.ETH (J12.88)
MCU_GPIO107: 1.GPIO (U1#1.L3), 2.Support (R72.2), 9.Pwm_Buffer (U26.1)
MCU_GPIO108: 1.GPIO (U1#1.L4), 5.ETH (J12.84)
MCU_GPIO109: 1.GPIO (U1#1.N2), 5.ETH (J12.94)
MCU_GPIO110: 1.GPIO (U1#1.M2), 5.ETH (J12.92)
MCU_GPIO111: 1.GPIO (U1#1.M4), 5.ETH (J12.86)
MCU_GPIO112: 1.GPIO (U1#1.M3), 5.ETH (J12.90)
MCU_GPIO113: 1.GPIO (U1#1.N4), 5.ETH (J12.98)
MCU_GPIO114: 1.GPIO (U1#1.N3), 5.ETH (J12.96)
MCU_GPIO115: 1.GPIO (U1#1.V12), 5.ETH (J12.95)
MCU_GPIO116: 1.GPIO (U1#1.W10), 5.ETH (J12.91)
MCU_GPIO117: 1.GPIO (U1#1.U12), 5.ETH (J12.97)
MCU_GPIO118: 1.GPIO (U1#1.T12), 5.ETH (J12.99)
MCU_GPIO119: 1.GPIO (U1#1.T15), 5.ETH (J12.10)
MCU_GPIO120: 1.GPIO (U1#1.U15), 9.Pwm_Buffer (U26.24)
MCU_GPIO121: 1.GPIO (U1#1.W16), 9.Pwm_Buffer (U28.46)
MCU_GPIO122: 1.GPIO (U1#1.T8), 5.ETH (J12.85)
MCU_GPIO123: 1.GPIO (U1#1.U8), 5.ETH (J12.89)
MCU_GPIO124: 1.GPIO (U1#1.V8), 5.ETH (J12.87)
MCU_GPIO125: 1.GPIO (U1#1.T9), 5.ETH (J12.93)
MCU_GPIO126: 1.GPIO (U1#1.U9), 5.ETH (J12.26)
MCU_GPIO127: 1.GPIO (U1#1.V9), 5.ETH (J12.3)
MCU_GPIO128: 1.GPIO (U1#1.W9), 5.ETH (J12.1)
MCU_GPIO129: 1.GPIO (U1#1.T10), 5.ETH (J12.19)
MCU_GPIO130: 1.GPIO (U1#1.U10), 5.ETH (J12.17)
MCU_GPIO131: 1.GPIO (U1#1.V10), 5.ETH (J12.15)
MCU_GPIO132: 1.GPIO (U1#1.W18), 5.ETH (J12.11)
MCU_GPIO133: 1.GPIO (U1#1.G18), 9.Pwm_Buffer (U26.37)
MCU_GPIO134: 1.GPIO (U1#1.V18), 5.ETH (J12.13)
MCU_GPIO135: 1.GPIO (U1#1.U18), 5.ETH (J12.5)
MCU_GPIO136: 1.GPIO (U1#1.T17), 5.ETH (J12.4)
MCU_GPIO137: 1.GPIO (U1#1.T18), 5.ETH (J12.8)
MCU_GPIO138: 1.GPIO (U1#1.T19), 5.ETH (J12.6)
MCU_GPIO139: 1.GPIO (U1#1.N19), 5.ETH (J12.18)
MCU_GPIO140: 1.GPIO (U1#1.M19), 5.ETH (J12.20)
MCU_GPIO141: 1.GPIO (U1#1.M18), 5.ETH (J12.22)
MCU_GPIO142: 1.GPIO (U1#1.L19), 5.ETH (J12.24)
MCU_GPIO143: 1.GPIO (U1#1.F18), 5.ETH (J12.23)
MCU_GPIO144: 1.GPIO (U1#1.F17), 5.ETH (J12.45)
MCU_GPIO145: 1.GPIO (U1#1.E17), 5.ETH (J12.25)
MCU_GPIO146: 1.GPIO (U1#1.D18), 5.ETH (J12.27)
MCU_GPIO147: 1.GPIO (U1#1.D17), 5.ETH (J12.42)
MCU_GPIO148: 1.GPIO (U1#1.D14), 5.ETH (J12.47)
MCU_GPIO149: 1.GPIO (U1#1.A13), 5.ETH (J12.49)
MCU_GPIO150: 1.GPIO (U1#1.B13), 5.ETH (J12.50)
MCU_GPIO151: 1.GPIO (U1#1.C13), 5.ETH (J12.48)
MCU_GPIO152: 1.GPIO (U1#1.D13), 5.ETH (J12.69)
MCU_GPIO153: 1.GPIO (U1#1.A12), 5.ETH (J12.71)
MCU_GPIO154: 1.GPIO (U1#1.B12), 5.ETH (J12.52)
MCU_GPIO155: 1.GPIO (U1#1.C12), 5.ETH (J12.54)
MCU_GPIO156: 1.GPIO (U1#1.D12), 5.ETH (J12.73)
MCU_GPIO157: 1.GPIO (U1#1.B10), 5.ETH (J12.81)
MCU_GPIO158: 1.GPIO (U1#1.C10), 5.ETH (J12.79)
MCU_GPIO159: 1.GPIO (U1#1.D10), 5.ETH (J12.75)
MCU_GPIO160: 1.GPIO (U1#1.B9), 5.ETH (J12.58)
MCU_GPIO161: 1.GPIO (U1#1.C9), 5.ETH (J12.77)
MCU_GPIO162: 1.GPIO (U1#1.D9), 5.ETH (J12.56)
MCU_GPIO163: 1.GPIO (U1#1.A8), 5.ETH (J12.60)
MCU_GPIO164: 1.GPIO (U1#1.B8), 5.ETH (J12.62)
MCU_GPIO165: 1.GPIO (U1#1.C5), 5.ETH (J12.74)
MCU_GPIO166: 1.GPIO (U1#1.D5), 5.ETH (J12.78)
MCU_GPIO167: 1.GPIO (U1#1.C4), 5.ETH (J12.76)
MCU_GPIO168: 1.GPIO (U1#1.D4), 5.ETH (J12.80)
MCU_TCK: 1.GPIO (J1.89), 2.Support (U1#1.V15), 8.Emulator_Interface (J11.9 J11.11 R173.1)
MCU_TDI: 1.GPIO (J1.92), 2.Support (U1#1.W13), 8.Emulator_Interface (J11.3 R172.1)
MCU_TDO: 1.GPIO (J1.90), 2.Support (R59.1), 8.Emulator_Interface (J11.7)
MCU_TMS: 1.GPIO (J1.87), 2.Support (U1#1.W14), 8.Emulator_Interface (J11.1 R171.1)
MCU_TRSTn: 1.GPIO (J1.88), 2.Support (R62.2 U1#1.V14), 8.Emulator_Interface (J11.2 R175.2)
MCU_XRSn: 1.GPIO (J2.22 J9.9), 2.Support (7 pins)
P0_PHY_CLK: 2.Support (R73.1 TP8.1), 5.ETH (J12.33)
P1_PHY_CLK: 2.Support (R76.1 TP9.1), 5.ETH (J12.29)